# Altium schematic sheet Drone_Mercury.SchDoc
size A4; SheetNumber: 1; SheetTotal: 1
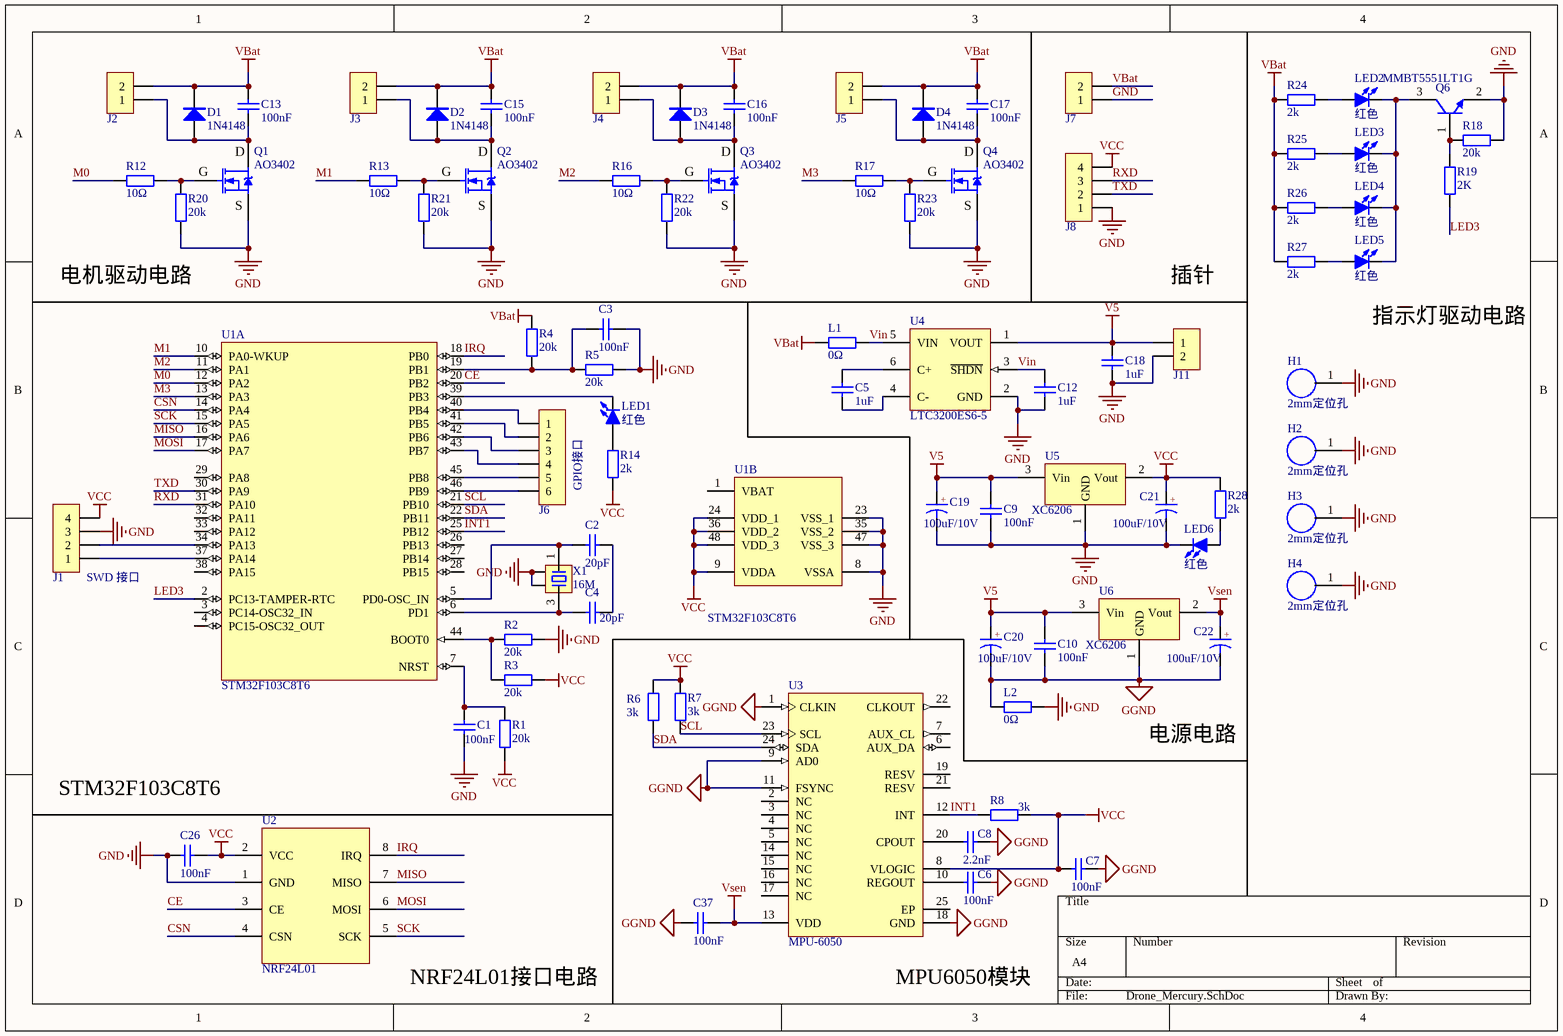
[diagram p0: Drone_Mercury.SchDoc]

## Parts
C1  100nF  [C0603_M]
C2  20pF  [C0603_M]
C3  100nF  [C0603_M]
C4  20pF  [C0603_M]
C5  1uF  [C0603_M]
C6  100nF  [C0603_M]
C7  100nF  [C0603_M]
C8  2.2nF  [C0603_M]
C9  100nF  [C0603_M]
C10  100nF  [C0603_M]
C12  1uF  [C0603_M]
C13  100nF  [C0603_M]
C15  100nF  [C0603_M]
C16  100nF  [C0603_M]
C17  100nF  [C0603_M]
C18  1uF  [C0603_M]
C19  100uF/10V  [C_3528]
C20  100uF/10V  [C_3528]
C21  100uF/10V  [C_3528]
C22  100uF/10V  [C_3528]
C26  100nF  [C0603_M]
C37  100nF  [C0603_M]
D1  1N4148  [SOD-323]
D2  1N4148  [SOD-323]
D3  1N4148  [SOD-323]
D4  1N4148  [SOD-323]
H1  2mm定位孔  [Pos-Hole]
H2  2mm定位孔  [Pos-Hole]
H3  2mm定位孔  [Pos-Hole]
H4  2mm定位孔  [Pos-Hole]
J1  SWD  [HDR2.54-LI-4P]  (value not drawn)
J2  电机SH1.0插母  [SH1.0-2p]  (value not drawn)
J3  电机SH1.0插母  [SH1.0-2p]  (value not drawn)
J4  电机SH1.0插母  [SH1.0-2p]  (value not drawn)
J5  电机SH1.0插母  [SH1.0-2p]  (value not drawn)
J6  HDR-1X6  [HDR2.54-LI-6P]  (value not drawn)
J7  电源线  [PWR_Bonding_Pad]  (value not drawn)
J8  HDR-1X4  [HDR2.54-LI-4P]  (value not drawn)
J11  HDR-1X2  [HDR2.54-LI-2P]  (value not drawn)
L1  0Ω  [R0805_L]
L2  0Ω  [R0805_L]
LED1  红色  [LED0603_R]
LED2  红色  [LED0603_R]
LED3  红色  [LED0603_R]
LED4  红色  [LED0603_R]
LED5  红色  [LED0603_R]
LED6  红色  [LED0603_R]
Q1  AO3402  [SOT23-3N]
Q2  AO3402  [SOT23-3N]
Q3  AO3402  [SOT23-3N]
Q4  AO3402  [SOT23-3N]
Q6  MMBT5551LT1G  [ONSC-SOT-23-3-318-08_V]
R1  20k  [R0603_M]
R2  20k  [R0603_M]
R3  20k  [R0603_M]
R4  20k  [R0603_M]
R5  20k  [R0603_M]
R6  3k  [R0603_M]
R7  3k  [R0603_M]
R8  3k  [R0603_M]
R12  10Ω  [R0603_M]
R13  10Ω  [R0603_M]
R14  2k  [R0603_M]
R16  10Ω  [R0603_M]
R17  10Ω  [R0603_M]
R18  20k  [R0603_M]
R19  2K  [R0603_M]
R20  20k  [R0603_M]
R21  20k  [R0603_M]
R22  20k  [R0603_M]
R23  20k  [R0603_M]
R24  2k  [R0603_M]
R25  2k  [R0603_M]
R26  2k  [R0603_M]
R27  2k  [R0603_M]
R28  2k  [R0603_M]
U1  STM32F103C8T6  [LQFP48_N]  (parts A,B of 2)
U2  NRF24L01  [HDR2.54-M-LS-2x4P]
U3  MPU-6050  [IS-QFN-24_V]
U4  LTC3200ES6-5  [LT-S6-6-TSOT-23_M]
U5  XC6206  [sot23]
U6  XC6206  [sot23]
X1  16M  [XTAL-3225-4P]

## Nets
GGND: C6.1 C7.1 C8.1 C10.1 C20.2(K) C22.2(K) C37.2 L2.2 U3.1(CLKIN) U3.9(AD0) U3.11(FSYNC) U3.18(GND) U6.1(GND)
GND: C1.1 C3.1 C9.1 C12.1 C18.1 C19.2(K) C21.2(K) C26.2 H1.1 H2.1 H3.1 H4.1 J1.3 J7.1 J8.1 J11.2 L2.1 LED6.2(K) Q1.2(S) Q2.2(S) Q3.2(S) Q4.2(S) Q6.2(E) R2.1 R5.2 R18.2 R20.1 R21.1 R22.1 R23.1 U1.8(VSSA) U1.23(VSS_1) U1.35(VSS_2) U1.47(VSS_3) U2.1(GND) U4.2(GND) U5.1(GND) X1.2 X1.4
V5: C9.2 C10.2 C18.2 C19.1(A) C20.1(A) J11.1 U4.1(VOUT) U5.3(Vin) U6.3(Vin)
VBat: C13.2 C15.2 C16.2 C17.2 D1.2(K) D2.2(K) D3.2(K) D4.2(K) J2.2 J3.2 J4.2 J5.2 J7.2 L1.2 R4.1 R24.2 R25.2 R26.2 R27.2
VCC: C7.2 C21.1(A) C26.1 J1.4 J8.4 R1.1 R3.1 R6.2 R7.2 R8.1 R14.1 R28.2 U1.9(VDDA) U1.24(VDD_1) U1.36(VDD_2) U1.48(VDD_3) U2.2(VCC) U3.8(VLOGIC) U5.2(Vout)
Vsen: C22.1(A) C37.1 U3.13(VDD) U6.2(Vout)
CE: U1.20(PB2) U2.3(CE)
CSN: U1.14(PA4) U2.4(CSN)
INT1: R8.2 U1.25(PB12) U3.12(INT)
IRQ: U1.18(PB0) U2.8(IRQ)
LED3: R19.2 U1.2(PC13-TAMPER-RTC)
M0: R12.1 U1.12(PA2)
M1: R13.1 U1.10(PA0-WKUP)
M2: R16.1 U1.11(PA1)
M3: R17.1 U1.13(PA3)
MISO: U1.16(PA6) U2.7(MISO)
MOSI: U1.17(PA7) U2.6(MOSI)
RXD: J8.3 U1.31(PA10)
SCK: U1.15(PA5) U2.5(SCK)
SCL: R7.1 U1.21(PB10) U3.23(SCL)
SDA: R6.1 U1.22(PB11) U3.24(SDA)
TXD: J8.2 U1.30(PA9)
Vin: C12.2 L1.1 U4.3(~{SHDN}) U4.5(VIN)
NetC1_2: C1.2 R1.2 U1.7(NRST)
NetC2_1: C2.1 U1.5(PD0-OSC_IN) X1.1
NetC2_2: C2.2 C4.2
NetC3_2: C3.2 R4.2 R5.1 U1.19(PB1)
NetC4_1: C4.1 U1.6(PD1) X1.3
NetC5_1: C5.1 U4.4(C-)
NetC5_2: C5.2 U4.6(C+)
NetC6_2: C6.2 U3.10(REGOUT)
NetC8_2: C8.2 U3.20(CPOUT)
NetC13_1: C13.1 D1.1(A) J2.1 Q1.3(D)
NetC15_1: C15.1 D2.1(A) J3.1 Q2.3(D)
NetC16_1: C16.1 D3.1(A) J4.1 Q3.3(D)
NetC17_1: C17.1 D4.1(A) J5.1 Q4.3(D)
NetJ1_1: J1.1 U1.37(PA14)
NetJ1_2: J1.2 U1.34(PA13)
NetJ6_1: J6.1 U1.40(PB4)
NetJ6_2: J6.2 U1.41(PB5)
NetJ6_3: J6.3 U1.42(PB6)
NetJ6_4: J6.4 U1.43(PB7)
NetJ6_5: J6.5 U1.45(PB8)
NetJ6_6: J6.6 U1.46(PB9)
NetLED1_1: LED1.1(A) R14.2
NetLED1_2: LED1.2(K) U1.39(PB3)
NetLED2_1: LED2.1(A) R24.1
NetLED2_2: LED2.2(K) LED3.2(K) LED4.2(K) LED5.2(K) Q6.3(C)
NetLED3_1: LED3.1(A) R25.1
NetLED4_1: LED4.1(A) R26.1
NetLED5_1: LED5.1(A) R27.1
NetLED6_1: LED6.1(A) R28.1
NetQ1_1: Q1.1(G) R12.2 R20.2
NetQ2_1: Q2.1(G) R13.2 R21.2
NetQ3_1: Q3.1(G) R16.2 R22.2
NetQ4_1: Q4.1(G) R17.2 R23.2
NetQ6_1: Q6.1(B) R18.1 R19.1
NetR2_2: R2.2 R3.2 U1.44(BOOT0)

Not connected (* = marked no-connect by the designer): U1 1(VBAT) 3(PC14-OSC32_IN) 4(PC15-OSC32_OUT) 26(PB13) 27(PB14) 28(PB15) 29(PA8) 32(PA11) 33(PA12) 38(PA15); U3 2(NC) 3(NC) 4(NC) 5(NC) 6(AUX_DA) 7(AUX_CL) 14(NC) 15(NC) 16(NC) 17(NC) 19(RESV) 21(RESV) 22(CLKOUT) 25(EP)

## Notes on the sheet
- (near R20) 电机驱动电路
- 插针
- 指示灯驱动电路
- GPIO接口
- (near J1) SWD 接口
- STM32F103C8T6
- 电源电路
- NRF24L01接口电路
- (near U3) MPU6050模块
- (in symbol CT) +

## Library data of the parts
C1-C10 C12 C13 C15-C18 C26 C37 = C: 贴片电容; BOM名称: 无极性贴片电容; 联系卖家，免费查找封装: 唯一出售店铺网址https://shop463601444.taobao.com
C19-C22 = CT: 贴片钽电容; 联系卖家，免费查找封装: 唯一出售店铺网址https://shop463601444.taobao.com; BOM名称: 贴片钽电容
D1-D4 = 1N4148: 开关二极管; BOM名称: 高速开关二极管; 联系卖家，免费查找封装: 唯一出售店铺网址https://shop463601444.taobao.com
H1-H4 = Hole
J1 = Header 4: 4P接插件; 封装库来自淘宝卖家 ID：黄晶宝石: 其他店铺购入均为盗版假冒封装库; 联系卖家，免费查找封装: 唯一出售店铺网址https://shop463601444.taobao.com; BOM名称: 4P接插件
J2-J5 J7 J11 = Header 2: 2P接插件; 封装库来自淘宝卖家 ID：黄晶宝石: 其他店铺购入均为盗版假冒封装库; 联系卖家，免费查找封装: 唯一出售店铺网址https://shop463601444.taobao.com; BOM名称: 2P接插件
J6 = Header 6: GPIO口; BOM名称: 6P接插件; 封装库来自淘宝卖家 ID：黄晶宝石: 其他店铺购入均为盗版假冒封装库; 联系卖家，免费查找封装: 唯一出售店铺网址https://shop463601444.taobao.com
J8 = Header 4: UART通信口; BOM名称: 4P接插件; 封装库来自淘宝卖家 ID：黄晶宝石: 其他店铺购入均为盗版假冒封装库; 联系卖家，免费查找封装: 唯一出售店铺网址https://shop463601444.taobao.com
L1 L2 R1-R8 R12-R14 R16-R28 = R: 贴片电阻; 联系卖家，免费查找封装: 唯一出售店铺网址https://shop463601444.taobao.com; BOM名称: 贴片电阻
LED1-LED6 = LED-SMD: 贴片LED; 联系卖家 免费查找封装: 封装库来自淘宝卖家ID：黄晶宝石; BOM名称: 贴片LED
Q1-Q4 = AO3400: N沟道 30V/4.2A; BOM名称: 场效应管; 联系卖家，免费查找封装: 唯一出售店铺网址https://shop463601444.taobao.com; 参数: N沟道 30V/4.2A
Q6 = CMP-1048-00669-1: High Voltage Transistor, NPN Silicon, 3-Pin SOT-23, Pb-Free, Tape and Reel; Manufacturer: On Semiconductor; IC Continuous (A): 0.6; ComponentLink2URL: http://www.onsemi.cn/pub_link/Collateral/MMBT5550LT1-D.PDF; ComponentLink3Description: Package Specification; Packing: Tape and Reel; DatasheetVersion: Rev. 10; ComponentLink1URL: http://www.onsemi.com/; ComponentLink2Description: Datasheet; Polarity: NPN; ComponentLink1Description: Manufacturer URL; PartNumber: MMBT5551LT1G; RoHS: TRUE; PackageReference: SOT-23-3-318-08; Mounting Technology: Surface Mount; PackageVersion: Rev. AP, 11/2009; ComponentLink3URL: http://www.onsemi.cn/pub_link/Collateral/318-08.PDF; PackageDescription: 3-Pin Small Outline Transistor, Body 2.92 x 1.3 mm, Pitch 0.95 mm
U1 = STM32F103C8T6: STM32 ARM-based 32-bit MCU Performance Line with 64 kB Flash, 20 kB Internal RAM, -40 to +85癈 Temperature, 48-Pin LQFP, Tray; 联系卖家，免费查找封装: 唯一出售店铺网址https://shop463601444.taobao.com; DatasheetVersion: rev13.0, Apr-2011; PackageVersion: rev13, Apr-2011; PackageReference: LQFP48; PackageDescription: 48-Pin Low-Profile Quad Flat Pack, 7 x 7 mm Body, 0.5 mm Pitch (LQFP48); ComponentLink1Description: Manufacturer URL; ComponentLink1URL: http://www.st.com/; ComponentLink2Description: STM32F103 Datasheet; ComponentLink2URL: http://www.st.com/internet/com/TECHNICAL_RESOURCES/TECHNICAL_LITERATURE/DATASHEET/CD00161566.pdf; ComponentLink3Description: STM32 Family Web Page; ComponentLink3URL: www.st.com/stm32
U2 = NRF24L01: pin to pad: 1>2 2>1 3>4 4>3 5>6 6>5 7>8 8>7
U3 = CMP-1753-00002-2: 3-Axis Gyroscope, Accelerometer and a Digital Motion Processor(TM) (DMP), 2.375 to 3.46 V, -40 to 85 degC, 24-Pin QFN, RoHS, Tape and Reel; Manufacturer: InvenSense; Featured Product: MPU-60506-Axis,IntegratedI²CSolution; Other Names: 1428-1007-2 / MPU6050; Sensor Type: MotionTracking; Online Catalog: MPU-6000™Series; Unit PriceUSD: Digital; Datasheet Version: Rev. 3.3, 05/2012; Category: Sensors,Transducers; Datasheet URL: http://datasheet.octopart.com/MPU-6050-InvenSense-datasheet-14421344.pdf; Family: Multifunction; Standard Package: 5,000; Manufacturer URL: http://www.invensense.com/; Output Type: Digital; Dynamic Catalog: MPU-6000™Series
U4 = CMP-0477-00281-1: Low Noise, Doubler / White LED Driver, 2.7 to 4.5 V Vin, 5 V Vout MAX, 6-pin SOT23 (S6-6), -40 to 85 degC, Pb-Free, Mini Tape and Reel; Manufacturer: Linear Technology; PartNumber: LTC3200ES6-5#TRMPBF; Vin Min(V): 2.7; Topology: Charge Pump, LED Driver; RoHS: TRUE; PackageDescription: 6-Pin Plastic TSOT-23, Body 2.9 x 1.63 mm, Pitch 0.95 mm; Code_JEDEC: MO-193; ComponentLink3Description: Package Specification; ComponentLink1URL: http://www.linear.com/; ComponentLink2Description: Datasheet; PackageVersion: Jun-10; Packing: Mini Tape and Reel; ComponentLink1Description: Manufacturer URL; ComponentLink2URL: http://cds.linear.com/docs/en/datasheet/32005f.pdf; Mounting Technology: Surface Mount; PackageReference: S6-6; ComponentLink3URL: http://cds.linear.com/docs/en/packaging/SOT_6_05-08-1636.pdf
X1 = XTAL-4P: 4脚无源晶振(谐振器）; 联系卖家，免费查找封装: 唯一出售店铺网址https://shop463601444.taobao.com; BOM名称: 4脚无源晶振(谐振器）